# EAGLE design Ver.2.1 (EAGLE 6.6.0)
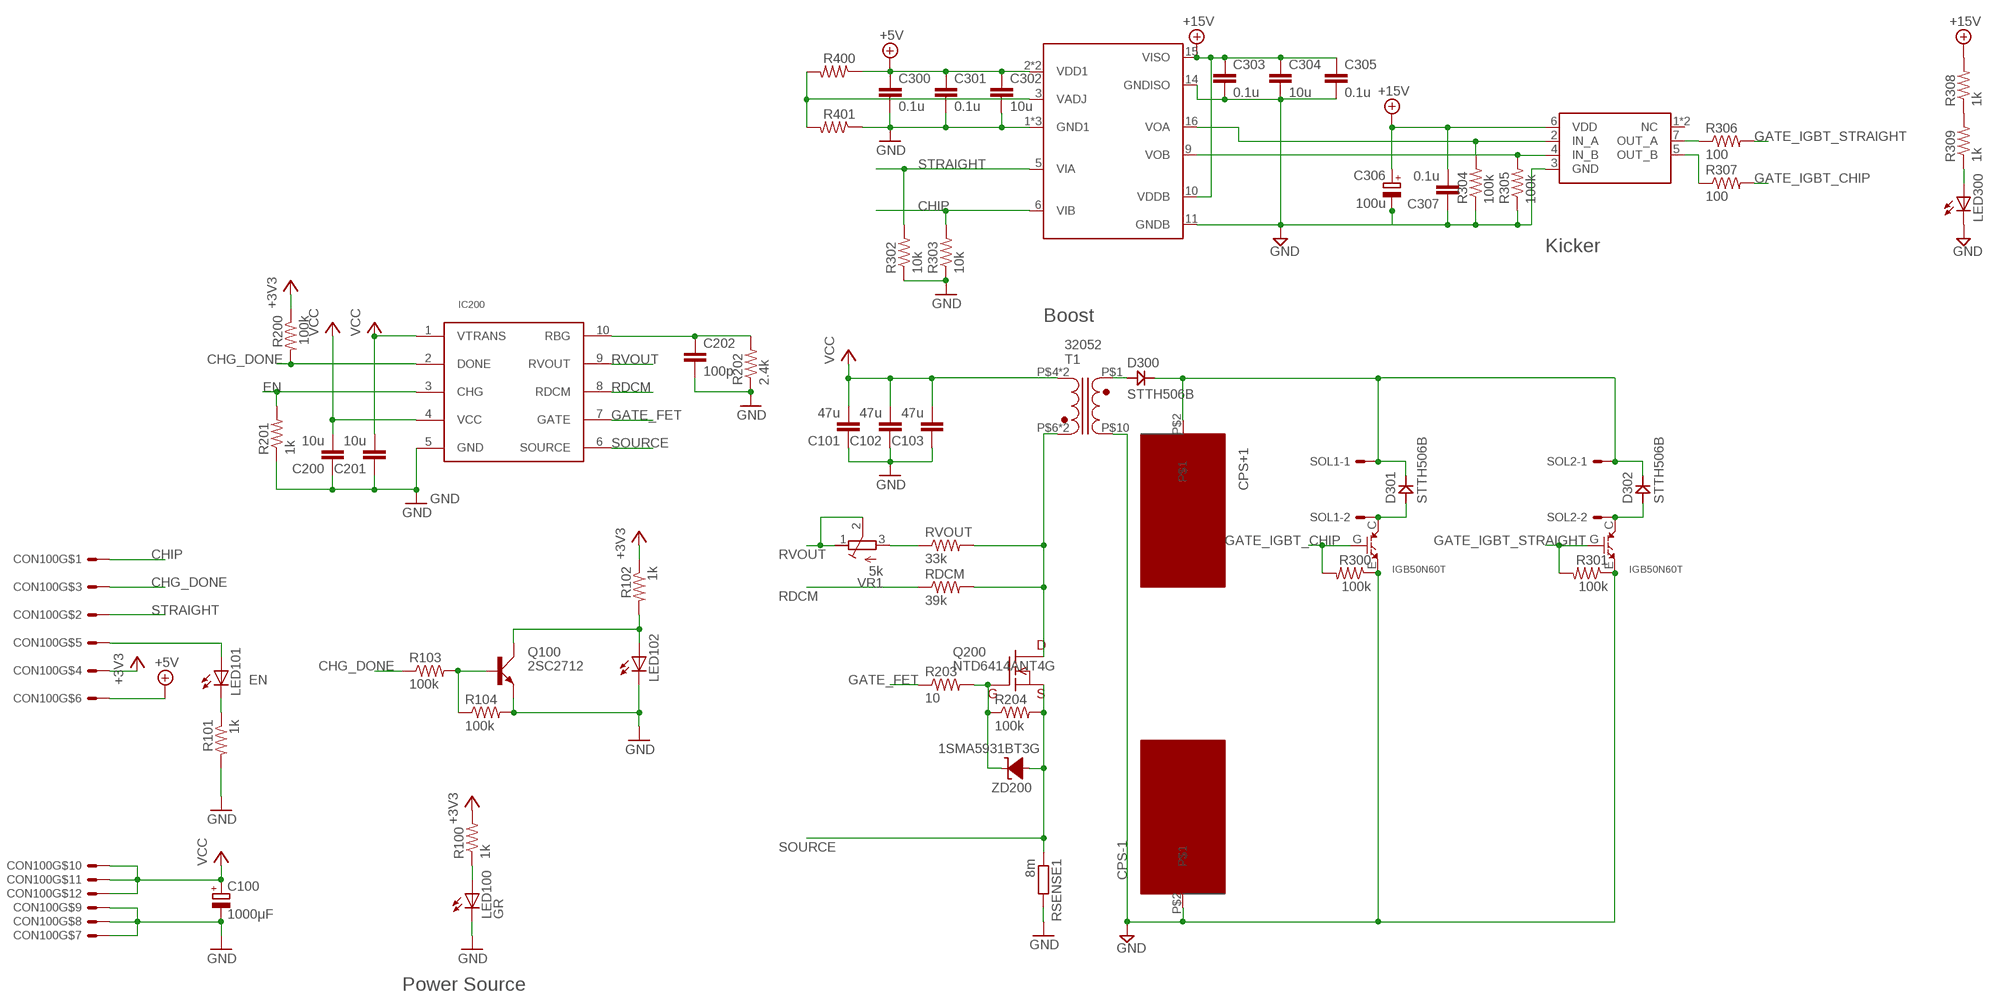
[diagram p0: schematic, sheet 1]

## Parts
C100  1000μF  CPOLE5-10  [E5-10]
C101  47u  CC3216  [C3216]
C102  47u  CC3216  [C3216]
C103  47u  CC3216  [C3216]
C200  10u  CC1608  [C1608]
C201  10u  CC1608  [C1608]
C202  100p  C5/5.5  [C5B5.5]
C300  0.1u  CC1608  [C1608]
C301  0.1u  CC1608  [C1608]
C302  10u  CC1608  [C1608]
C303  0.1u  CC1608  [C1608]
C304  10u  CC1608  [C1608]
C305  0.1u  CC1608  [C1608]
C306  100u  CPOLE2.5-6  [E2,5-6]
C307  0.1u  CC1608  [C1608]
CON100  12B-XH-AB12B  [B12B-XH-A]
CPS+1  POWER_SOURCE_PAD  [POWER_SOURCE_PAD]
CPS-1  POWER_SOURCE_PAD  [POWER_SOURCE_PAD]
D300  STTH506B  [DPAK]
D301  STTH506B  [DPAK]
D302  STTH506B  [DPAK]
IC200  LT3750  [MSOP10]
IC300  ADUM5230  [SOIC-16]
IC301  TC4427  [SOIC-8]
LED100  GR  LED3MM  [LED3MM]
LED101  LED3MM  [LED3MM]
LED102  LED3MM  [LED3MM]
LED300  LED3MM  [LED3MM]
Q100  2SC2712  2SC18153325  [TO23]
Q200  NTD6414ANT4G  IPD600N25N3  [TO-252]
Q300  IGB50N60T  HGTP20N60A4  [D2PACK]
Q301  IGB50N60T  HGTP20N60A4  [D2PACK]
R100  1k  R-US_R1608  [R1608]
R101  1k  R-US_R1608  [R1608]
R102  1k  R-US_R1608  [R1608]
R103  100k  R-US_R1608  [R1608]
R104  100k  R-US_R1608  [R1608]
R200  100k  R-US_R1608  [R1608]
R201  1k  R-US_R1608  [R1608]
R202  2.4k  R-US_0204/5S  [0204/5S]
R203  10  R-US_0204/7  [0204/7]
R204  100k  R-US_R1608  [R1608]
R300  100k  R-US_R1608  [R1608]
R301  100k  R-US_R1608  [R1608]
R302  10k  R-US_R1608  [R1608]
R303  10k  R-US_R1608  [R1608]
R304  100k  R-US_R1608  [R1608]
R305  100k  R-US_R1608  [R1608]
R306  100  R-US_R1608  [R1608]
R307  100  R-US_R1608  [R1608]
R308  1k  R-US_R1608  [R1608]
R309  1k  R-US_R1608  [R1608]
R400  R-US_R1608  [R1608]
R401  R-US_R1608  [R1608]
RDCM  39k  R-US_0204/7  [0204/7]
RSENSE1  8m  R-EU_M3216  [M3216]
RVOUT  33k  R-US_0204/7  [0204/7]
SOL1  KK-156-2-RA-NH  [22-05-3021-NH]
SOL2  KK-156-2-RA-NH  [22-05-3021-NH]
T1  32052  [32052]
VR1  5k  R-TRIMM  [RTRIM64W_S]
ZD200  1SMA5931BT3G  ZDIODEDO214AC  [DO214AC]

## Nets
200: CPS+1.P$2 D300.K D301.K D302.K SOL1.1 SOL2.1
+3V3: CON100.4 R100.2 R102.1 R200.1
+5V: C300.1 C301.1 C302.1 CON100.6 IC300.2(VDD1) IC300.7(VDD1) R400.1
+15V: C303.1 C304.1 C305.1 C306.+ C307.2 IC300.10(VDDB) IC300.15(VISO) IC301.6(VDD) R308.2
C_GND: C303.2 C304.2 C305.2 C306.- C307.1 CPS-1.P$2 IC300.11(GNDB) IC300.14(GNDISO) IC301.3(GND) LED300.K(C) Q300.E Q301.E R300.1 R301.1 R304.1 R305.1 T1.P$10 ; supply symbol labelled GND
CHG_DONE: CON100.3 IC200.2(DONE) R103.1 R200.2
CHIP: CON100.1 IC300.6(VIB) R303.2
EN: CON100.5 IC200.3(CHG) LED101.A R201.2
GATE_FET: IC200.7(GATE) R203.1
GATE_IGBT_CHIP: Q300.G R300.2 R307.2
GATE_IGBT_STRAIGHT: Q301.G R301.2 R306.2
GND: C100.- C101.1 C102.1 C103.1 C200.1 C201.1 C202.2 C300.2 C301.2 C302.2 CON100.7 CON100.8 CON100.9 IC200.5(GND) IC300.1(GND1) IC300.4(GND1) IC300.8(GND1) LED100.K(C) LED102.K(C) Q100.E R101.2 R104.2 R201.1 R202.1 R302.1 R303.1 R401.1 RSENSE1.2
N$1: LED100.A R100.1
N$2: Q200.D RDCM.2 RVOUT.2 T1.P$6 T1.P$7
N$3: Q200.G R203.2 R204.1 ZD200.C(K)
N$4: RVOUT.1 VR1.3(E)
N$5: D300.A T1.P$1
N$6: D301.A Q300.C SOL1.2
N$7: D302.A Q301.C SOL2.2
N$8: Q100.B R103.2 R104.1
N$9: LED300.A R309.1
N$10: C202.1 IC200.10(RBG) R202.2
N$11: LED102.A Q100.C R102.2
N$12: IC300.9(VOB) IC301.4(IN_B) R305.2
N$13: IC300.16(VOA) IC301.2(IN_A) R304.2
N$14: IC300.3(VADJ) R400.2 R401.2
N$15: R308.1 R309.2
N$22: IC301.7(OUT_A) R306.1
N$26: IC301.5(OUT_B) R307.1
N$27: LED101.K(C) R101.1
RDCM: IC200.8(RDCM) RDCM.1
RVOUT: IC200.9(RVOUT) VR1.1(A) VR1.2(S)
SOURCE: IC200.6(SOURCE) Q200.S R204.2 RSENSE1.1 ZD200.A
STRAIGHT: CON100.2 IC300.5(VIA) R302.2
VCC: C100.+ C101.2 C102.2 C103.2 C200.2 C201.2 CON100.10 CON100.11 CON100.12 IC200.1(VTRANS) IC200.4(VCC) T1.P$4 T1.P$5
Unconnected: IC301.1(NC) IC301.8(NC)

## Notes on the sheet
- Kicker
- Boost
- Power Source

## Library data of the parts
C100 C306 = CPOL:CPOL
C101-C103 C200-C202 C300-C305 C307 = capacitor:C: CAPACITOR naming: grid - package width
CON100 = Con-JST:*12B-XH-A
CPS+1 CPS-1 = power_source_pad:POWER_SOURCE_PAD
D300-D302 = Diode:STTH506B
IC200 = IC:LT3750
IC300 = GateDriver:ADUM5230
IC301 = GateDriver:TC4427
LED100-LED102 LED300 = LED:LED: LED OSRAM: - CHIPLED LG R971, LG N971, LY N971, LG Q971, LY Q971, LO R971, LY R971 LH N974, LH R974 LS Q976, LO Q976, LY Q976 LO Q996 - Hyper CHIPLED LW Q18S LB Q993, LB Q99A, LB R99A - SideLED LS A670, LO A670, LY A670, LG A670, LP A670 LB A673, LV A673, LT A673, LW A673 LH A674 LY A675 LS A676, LA A676, LO A676, LY A676, LW A676 LS A679, LY A679, LG A679 - Hyper Micro SIDELED® LS Y876, LA Y876, LO Y876, LY Y876 LT Y87S - SmartLED LW L88C, LW L88S LB L89C, LB L89S, LG L890 LS L89K, LO L89K, LY L89K LS L896, LA L896, LO L896, LY L896 - TOPLED LS T670, LO T670, LY T670, LG T670, LP T670 LSG T670, LSP T670, LSY T670, LOP T670, LYG T670 LG T671, LOG T671, LSG T671 LB T673, LV T673, LT T673, LW T673 LH T674 LS T676, LA T676, LO T676, LY T676, LB T676, LH T676, LSB T676, LW T676 LB T67C, LV T67C, LT T67C, LS T67K, LO T67K, LY T67K, LW E67C LS E67B, LA E67B, LO E67B, LY E67B, LB E67C, LV E67C, LT E67C LW T67C LS T679, LY T679, LG T679 LS T770, LO T770, LY T770, LG T770, LP T770 LB T773, LV T773, LT T773, LW T773 LH T774 LS E675, LA E675, LY E675, LS T675 LS T776, LA T776, LO T776, LY T776, LB T776 LHGB T686 LT T68C, LB T68C - Hyper Mini TOPLED® LB M676 - Mini TOPLED Santana® LG M470 LS M47K, LO M47K, LY M47K Source: http://www.osram.convergy.de LUXEON: - LUMILED® LXK2-PW12-R00, LXK2-PW12-S00, LXK2-PW14-U00, LXK2-PW14-V00 LXK2-PM12-R00, LXK2-PM12-S00, LXK2-PM14-U00 LXK2-PE12-Q00, LXK2-PE12-R00, LXK2-PE12-S00, LXK2-PE14-T00, LXK2-PE14-U00 LXK2-PB12-K00, LXK2-PB12-L00, LXK2-PB12-M00, LXK2-PB14-N00, LXK2-PB14-P00, LXK2-PB14-Q00 LXK2-PR12-L00, LXK2-PR12-M00, LXK2-PR14-Q00, LXK2-PR14-R00 LXK2-PD12-Q00, LXK2-PD12-R00, LXK2-PD12-S00 LXK2-PH12-R00, LXK2-PH12-S00 LXK2-PL12-P00, LXK2-PL12-Q00, LXK2-PL12-R00 Source: www.luxeon.com KINGBRIGHT: KA-3528ASYC Source: www.kingbright.com
Q100 = transistor-npn:2SC1815: NPN TRANSISTOR
Q200 = fet:IPD600N25N3
Q300 Q301 = IGBT:HGTP20N60A4
R100-R104 R200-R204 R300-R309 R400 R401 RDCM RVOUT = registor:R-US_: RESISTOR, American symbol
RSENSE1 = resistor:R-EU_: RESISTOR, European symbol
SOL1 SOL2 = con-molex:KK-156-2: KK 156 HEADER Source: http://www.molex.com/pdm_docs/sd/026604100_sd.pdf
T1 = Trans:32052
VR1 = registor:R-TRIMM: Trimm resistor
ZD200 = Diode:ZDIODE: ZENER DIODE

## Board
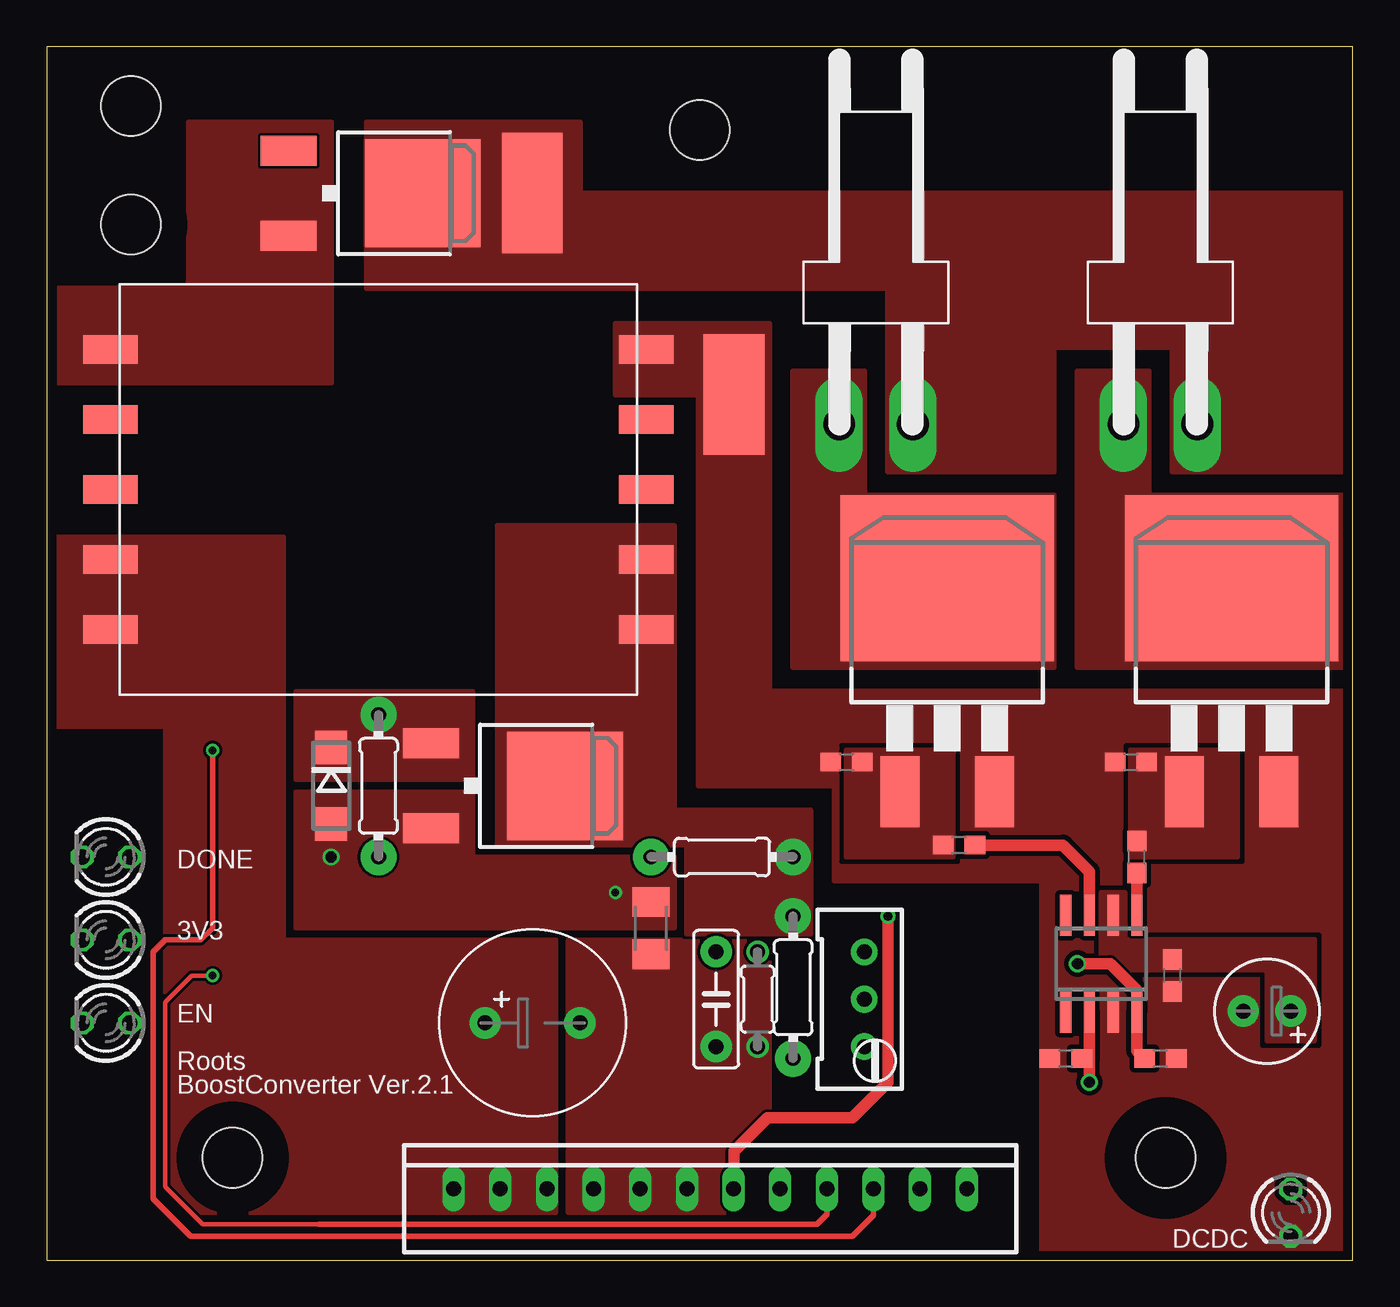
[diagram p1: board, top side]
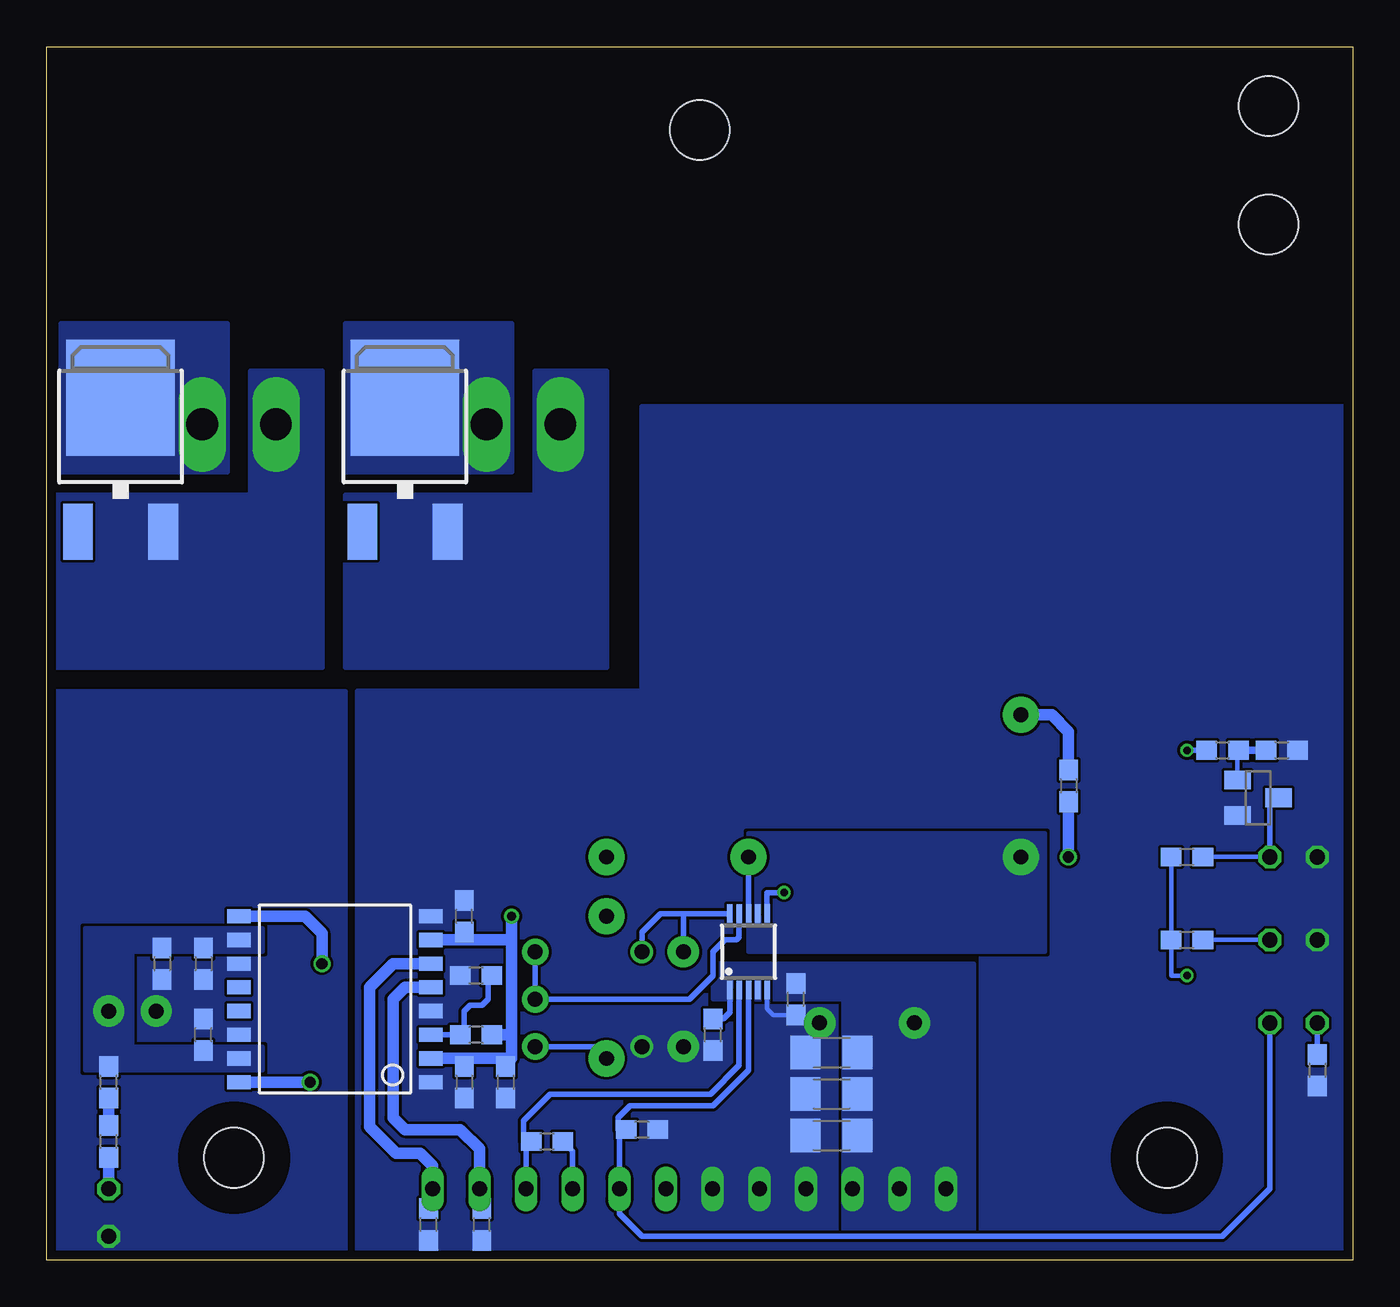
[diagram p2: board, bottom side, seen from below]

Size 70 x 65 mm. Coordinates in mm from the lower left corner, seen from the top.
Outline: 0,0 70,0 70,65 0,65 0,0
Copper layers (1*16): Top 0.035mm / dielectric 1.6mm / Bottom 0.035mm
Design rules "Elecrow_2-layer_PCB_eagle_rule": minimum track width 6mil, minimum drill 12mil, track to track 6mil, track to pad 6mil, pad to pad 6mil, via to via 8mil, smd to smd 0mil, copper to edge 20mil, drill to drill 10mil, minimum pad ring 6mil, minimum via ring 6mil, stop-mask expansion 0mil, vias tented up to drill 100mil, thermal gap 10mil
Holes 3.2 mm at 4.52,55.47 9.96,5.48 59.96,5.48 4.52,61.82 35,60.55
tRestrict: area 7,2.5 to 13,8.5; area 57,2.5 to 63,8.5; area 32,57.5 to 38,63.5; area 1.5,58.8 to 7.5,64.8; area 1.5,52.5 to 7.5,58.5
bRestrict: area 7,2.5 to 13,8.5; area 57,2.5 to 63,8.5; area 32,57.5 to 38,63.5; area 1.5,52.5 to 7.5,58.5

### Footprints (pad centres in the part's own frame; a part is rotated, then mirrored left to right if it is on the bottom)
E5-10 = drill 0.8 pad 1.676: + -2.54,0; - 2.54,0
C3216 = smd 1.6 x 1.8: 1 -1.4,0; 2 1.4,0
C1608 = smd 1.1 x 1: 1 -0.85,0; 2 0.85,0
C5B5.5 = drill 0.8 pad 1.676: 1 -2.54,0; 2 2.54,0
E2,5-6 = drill 0.8 pad 1.676: + -1.27,0; - 1.27,0
B12B-XH-A = drill 0.8 long: 1 -13.75,0; 2 -11.25,0; 3 -8.75,0; 4 -6.25,0; 5 -3.75,0; 6 -1.25,0; 7 1.25,0; 8 3.75,0; 9 6.25,0; 10 8.75,0; 11 11.25,0; 12 13.75,0
POWER_SOURCE_PAD = smd 6.452 x 3.251: P$2 0,0
DPAK = smd 1.6 x 3: A 2.28,-4.8; NC -2.28,-4.8 | smd 5.8 x 6.2: K 0,2.38
MSOP10 = smd 0.3 x 1: 1 -1,-2.05; 2 -0.5,-2.05; 3 0,-2.05; 4 0.5,-2.05; 5 1,-2.05; 6 1,2.05; 7 0.5,2.05; 8 0,2.05; 9 -0.5,2.05; 10 -1,2.05
SOIC-16 = smd 0.762 x 1.27: 1 -3.81,-5.207; 2 -2.54,-5.207; 3 -1.27,-5.207; 4 0,-5.207; 5 1.27,-5.207; 6 2.54,-5.207; 7 3.81,-5.207; 8 5.08,-5.207; 9 5.08,5.08; 10 3.81,5.08; 11 2.54,5.08; 12 1.27,5.08; 13 0,5.08; 14 -1.27,5.08; 15 -2.54,5.08; 16 -3.81,5.08
SOIC-8 = smd 0.6 x 2.2: 1 -1.905,-2.6; 2 -0.635,-2.6; 3 0.635,-2.6; 4 1.905,-2.6; 5 1.905,2.6; 6 0.635,2.6; 7 -0.635,2.6; 8 -1.905,2.6
LED3MM = drill 0.813 octagon: A -1.27,0; K 1.27,0
TO23 = smd 1 x 1.4: B -0.95,-1.1; C 0,1.1; E 0.95,-1.1
TO-252 = smd 5.8 x 6.2: D 0,2.38 | smd 1.6 x 3: G -2.28,-4.8; S 2.28,-4.8
D2PACK = smd 11.43 x 8.89: C 0,2.54 | smd 2.083 x 3.81: E 2.54,-8.89; G -2.54,-8.89
R1608 = smd 1.1 x 1: 1 -0.85,0; 2 0.85,0
0204/5S = drill 0.8: 1 -2.54,0; 2 2.54,0
0204/7 = drill 0.8 pad 1.93: 1 -3.81,0; 2 3.81,0
M3216 = smd 1.6 x 2: 1 -1.4,0; 2 1.4,0
22-05-3021-NH = drill 1.7 long: 1 -1.98,0; 2 1.98,0
32052 = smd 2.92 x 1.52: P$1 -14.35,7.5; P$2 -14.35,3.75; P$3 -14.35,0; P$4 -14.35,-3.75; P$5 -14.35,-7.5; P$6 14.35,-7.5; P$7 14.35,-3.75; P$8 14.35,0; P$9 14.35,3.75; P$10 14.35,7.5
RTRIM64W_S = drill 0.8 pad 1.422: 1 0,-2.54; 2 0,0; 3 0,2.54
DO214AC = smd 1.8 x 1.7: A 2.05,0; C -2.05,0

### Placement (x,y rotation side)
C100  26.04,12.7 0 top
C101  27.94,6.67 0 bottom
C102  27.94,8.89 0 bottom
C103  27.94,11.11 0 bottom
C200  29.84,13.97 90 bottom
C201  34.29,12.06 90 bottom
C202  35.88,13.97 270 top
C300  47.62,18.41 90 bottom
C301  47.62,9.53 270 bottom
C302  45.4,9.53 270 bottom
C303  61.59,15.88 270 bottom
C304  63.82,15.88 270 bottom
C305  61.59,12.06 90 bottom
C306  65.41,13.34 180 top
C307  60.33,15.24 90 top
CON100  35.56,3.81 180 top
CPS+1  26.04,57.15 90 top
CPS-1  36.83,46.35 270 top
D300  17.78,57.15 270 top
D301  66.04,43.81 0 bottom
D302  50.8,43.81 0 bottom
IC200  32.38,16.51 0 bottom
IC300  54.61,13.34 90 bottom
IC301  56.52,15.88 0 top
LED100  3.17,17.14 180 top
LED101  3.17,12.7 180 top
LED102  3.17,21.59 180 top
LED300  66.67,2.54 270 top
Q100  5.08,24.77 270 bottom
Q200  25.4,25.4 270 top
Q300  63.5,33.97 0 top
Q301  48.26,33.97 0 top
R100  8.89,17.14 180 bottom
R101  1.91,10.16 270 bottom
R102  8.89,21.59 0 bottom
R103  6.99,27.3 0 bottom
R104  3.81,27.3 0 bottom
R200  43.18,6.35 180 bottom
R201  38.1,6.99 180 bottom
R202  38.1,13.97 90 top
R203  17.78,25.4 90 top
R204  15.24,25.4 270 bottom
R300  58.1,26.67 0 top
R301  42.86,26.67 0 top
R302  46.67,1.91 90 bottom
R303  49.53,1.91 90 bottom
R304  54.61,10.79 0 top
R305  59.69,10.79 180 top
R306  48.9,22.23 180 top
R307  58.42,21.59 90 top
R308  66.67,9.53 90 bottom
R309  66.67,6.35 90 bottom
R400  46.99,12.06 180 bottom
R401  46.99,15.24 0 bottom
RDCM  36.2,21.59 0 top
RSENSE1  32.38,17.78 270 top
RVOUT  40.01,14.61 90 top
SOL1  59.69,44.77 180 top
SOL2  44.45,44.77 180 top
T1  17.78,41.27 0 top
VR1  43.81,13.97 180 top
ZD200  15.24,25.4 270 top

### Tracks (layer width: path | path; a pad name or v marks a point on that pad's centre or on a via)
200
  pour Top (no thermals): 17.14,60.96 17.14,52.07 45.09,52.07 45.09,42.23 53.98,42.23 53.98,48.9 60.33,48.9 60.33,42.23 69.85,42.23 69.85,57.15 28.57,57.15 28.57,60.96
  pour Bottom (no thermals): 53.98,50.16 45.09,50.16 45.09,42.23 53.98,42.23
  pour Bottom (no thermals): 60.33,50.16 60.33,42.23 69.22,42.23 69.22,50.16
+3V3  (via drill 0.4)
  Top 0.254: 14.61,1.91 8.36,1.91 6.35,3.91 6.35,13.82 7.77,15.24 v8.89,15.24
  Top 0.305: 14.61,1.91 41.27,1.91 41.81,2.44 CON100.4
  Bottom 0.254: R102.1 R100.2 9.74,15.24 v8.89,15.24
  Bottom 0.305: R200.1 41.81,5.83 CON100.4
+5V  (via drill 0.5)
  Top 0.61: CON100.6 36.83,3.81 36.83,5.82 38.63,7.62 43.18,7.62 45.09,9.53 v45.09,18.41
  Bottom 0.61: IC300.7 47.62,17.14 | 47.62,17.14 45.09,17.14 | 45.09,17.14 v45.09,18.41 | 47.62,17.78 C300.1 47.62,17.14 | IC300.2 47.62,10.79 | 47.62,10.79 45.4,10.79 | 45.09,17.14 45.09,12.06 | 45.09,12.06 45.09,10.79 45.4,10.79 | 45.4,10.79 C302.1 | C301.1 47.62,10.79 | R400.1 45.09,12.06
+15V
  pour Bottom (no thermals): 67.94,17.78 58.42,17.78 58.42,16.51 65.41,16.51 65.41,11.43 58.42,11.43 58.42,10.16 67.94,10.16
  pour Top (no thermals): 67.94,17.14 67.94,11.75 65.41,11.75 65.41,15.56 56.52,15.56 56.52,19.68 57.78,19.68 57.78,17.14
C_GND
  pour Top (isolate 0.254, rank 2, no thermals): 30.48,50.16 30.48,46.35 34.92,46.35 34.92,25.4 42.23,25.4 42.23,20.32 53.34,20.32 53.34,0 69.85,0 69.85,30.48 38.73,30.48 38.73,50.16
  pour Bottom (rank 6, no thermals): 69.85,30.48 53.98,30.48 53.98,0 69.85,0
CHG_DONE  (via drill 0.4)
  Top 0.305: v8.89,27.3 8.89,17.78 8.26,17.14 6.35,17.14 5.71,16.51 5.71,3.28 7.72,1.27 43.18,1.27 44.31,2.4 CON100.3
  Bottom 0.305: IC200.2 32.88,10.43 34.43,8.89 43.03,8.89 44.45,7.47 44.45,6.35 R200.2 44.31,6.07 CON100.3 | R103.1 v8.89,27.3
CHIP
  Bottom 0.61: IC300.6 51.44,15.88 52.7,14.61 52.7,7.13 51.28,5.71 49.98,5.71 49.31,5.04 CON100.1 49.31,2.75 R303.2
EN
  Bottom 0.305: IC200.3 32.38,10.16 34.29,8.26 38.73,8.26 39.37,7.62 39.37,6.99 | 39.37,6.99 R201.2 | LED101.A 4.45,3.81 6.99,1.27 38.1,1.27 39.31,2.48 CON100.5 39.31,6.92 39.37,6.99
GATE_FET
  pour Bottom (no thermals): 16.51,22.86 16.51,16.51 32.38,16.51 32.38,22.86
GATE_IGBT_CHIP
  pour Top (no thermals): 58.1,27.3 58.1,21.59 63.82,21.59 63.82,27.3
GATE_IGBT_STRAIGHT
  pour Top (no thermals): 48.58,27.3 42.86,27.3 42.86,21.59 48.58,21.59
GND
  Bottom 0.254: C200.1 31.04,13.12 31.39,13.46 IC200.5
  pour Bottom (rank 2, no thermals): -0.64,45.72 -0.64,0 53.34,0 53.34,30.48 38.1,30.48 38.1,45.72
  pour Top (rank 6, no thermals): 27.94,17.14 38.73,17.14 38.73,2.54 27.94,2.54
N$1
  Bottom 0.254: R100.1 LED100.A
N$2
  pour Top (no thermals): 33.66,39.37 24.13,39.37 24.13,22.23 34.29,22.23 34.29,17.46 40.96,17.46 40.96,24.13 33.66,24.13
N$3
  Bottom 0.61: R204.1 15.24,28.31 16.14,29.21 R203.2
  pour Top (no thermals): 13.34,30.48 13.34,25.72 22.86,25.72 22.86,30.48
N$4
  Bottom 0.305: VR1.3 40.64,11.43 RVOUT.1
N$5
  pour Top (no thermals): 0.64,46.99 15.24,46.99 15.24,60.96 7.62,60.96 7.62,52.07 0.64,52.07
N$6
  pour Top (no thermals): 59.05,47.62 55.24,47.62 55.24,31.75 69.85,31.75 69.85,40.96 59.05,40.96
  pour Bottom (no thermals): 59.05,47.62 55.24,47.62 55.24,31.75 69.85,31.75 69.85,40.96 59.05,40.96
N$7
  pour Top (no thermals): 43.81,47.62 40.01,47.62 40.01,31.75 53.98,31.75 53.98,40.96 43.81,40.96
  pour Bottom (no thermals): 43.81,47.62 40.01,47.62 40.01,31.75 53.98,31.75 53.98,40.96 43.81,40.96
N$8
  Bottom 0.254: R103.2 6.18,27.3 Q100.B
  Bottom 0.406: R104.1 R103.2
N$9
  Bottom 0.61: LED300.A R309.1
N$10
  Bottom 0.305: IC200.10 35.88,18.56 | 35.88,18.56 C202.1 | 35.88,18.56 37.09,18.56 38.1,17.55 R202.2
N$11
  Bottom 0.254: R102.2 LED102.A
  Bottom 0.305: Q100.C 4.45,24.77 LED102.A
N$12  (via drill 0.6 pad 0.25)
  Top 0.61: v55.24,15.88 57,15.88 58.42,14.46 IC301.4 58.42,11.21 R305.2
  Bottom 0.61: IC300.9 56.14,18.41 55.24,17.52 v55.24,15.88
N$13  (via drill 0.6 pad 0.25)
  Top 0.61: IC301.2 55.88,10.79 | 55.88,10.79 R304.2 | v55.88,9.53 55.88,10.79
  Bottom 0.61: IC300.16 v55.88,9.53
N$14
  Bottom 0.305: IC300.3 R400.2 47.62,12.06 47.62,13.34 47.31,13.65 46.67,13.65 46.35,13.97 46.35,15.24 R401.2
N$15
  Bottom 0.61: R309.2 R308.1
N$22
  Top 0.61: R306.1 54.46,22.23 55.88,20.8 IC301.7
N$26
  Top 0.61: IC301.5 R307.1
N$27
  Bottom 0.305: R101.1 LED101.K
RDCM
  Bottom 0.305: RDCM.1 IC200.8
RVOUT
  Bottom 0.305: VR1.1 VR1.2 35.56,13.97 34.29,15.24 34.29,16.51 33.66,17.14 33.02,17.14 32.88,17.28 IC200.9
SOURCE  (via drill 0.4, 0.6)
  Bottom 0.305: v30.48,19.68 31.39,19.68 IC200.6
  Bottom 0.61: R204.2 v15.24,21.59
  pour Top (no thermals): 13.34,25.08 13.34,17.78 33.66,17.78 33.66,21.59 22.86,21.59 22.86,25.08
STRAIGHT
  Bottom 0.406: R302.2 46.81,2.75
  Bottom 0.61: IC300.5 50.8,14.61 51.44,13.97 51.44,7.62 50.8,6.99 47.84,6.99 46.81,5.95 CON100.2 46.81,2.75
VCC
  Bottom 0.305: C201.2 33.73,12.91 33.38,13.26 IC200.1
  pour Top (no thermals): 0,38.73 0,28.57 6.35,28.57 6.35,2.54 27.3,2.54 27.3,17.14 12.7,17.14 12.7,38.73
  pour Bottom (no thermals): 20.32,1.27 20.32,15.88 34.29,15.88 34.29,13.97 27.3,13.97 27.3,1.27

### Text on the board
tNames: DONE | 3V3 | EN | Roots | BoostConverter Ver.2.1 | DCDC